# Altium schematic sheet MCU.SchDoc
size A3
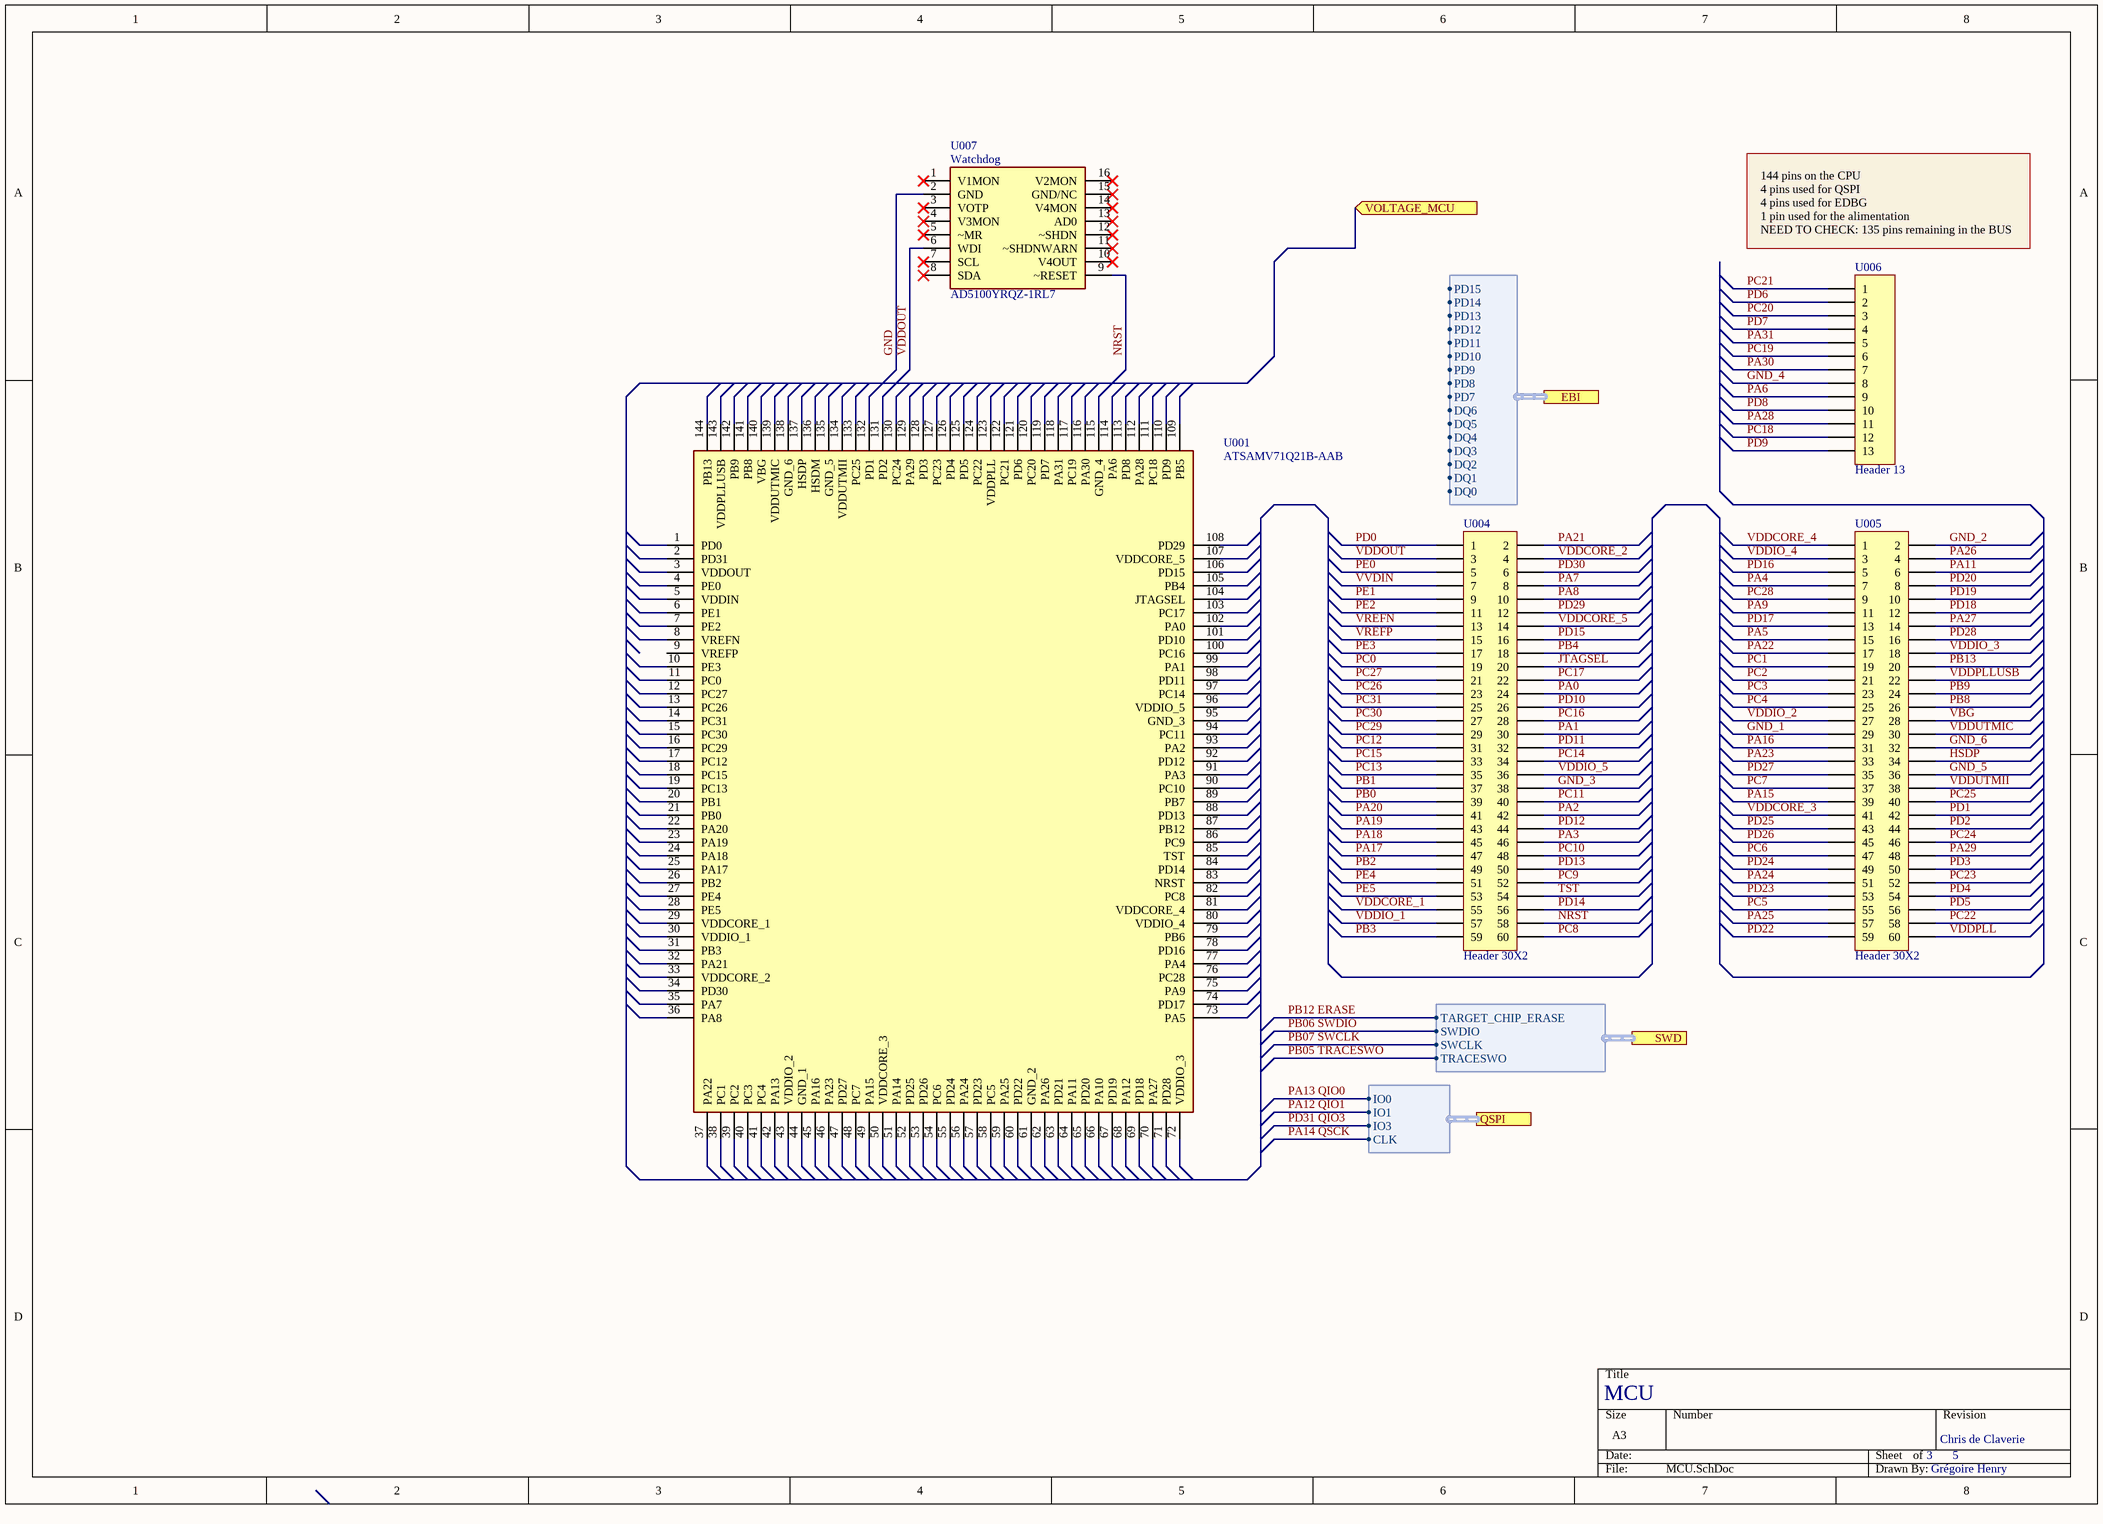
[diagram p0: MCU.SchDoc]

## Parts
U001  ATSAMV71Q21B-AAB  [QFP50P2200X2200X160-144N]
U004  Header 30X2  [HDR2X30]
U005  Header 30X2  [HDR2X30]
U006  Header 13  [HDR1X13]
U007  AD5100YRQZ-1RL7  [SOP65P600X175-16N]

## Ports
EBI (harness *), QSPI (harness *), SWD (harness *), VOLTAGE_MCU (in)

## Harnesses
*: IO0, IO1, IO3, CLK
*: TRACESWO, SWCLK, SWDIO, TARGET_CHIP_ERASE
*: DQ1, DQ0, DQ2, DQ3, DQ4, DQ5, PD7, DQ6, PD8, PD9, PD10, PD13, PD12, PD15, PD14, PD11

## Nets
GND: U007.2(GND)
GND_1: U005.29
GND_2: U005.2
GND_3: U004.38
GND_4: U006.8
GND_5: U005.36
GND_6: U005.32
HSDP: U005.34
JTAGSEL: U004.20
NRST: U004.58 U007.9(~RESET)
PA0: U004.24
PA1: U004.30
PA2: U004.42
PA3: U004.46
PA4: U005.7
PA5: U005.15
PA6: U006.9
PA7: U004.8
PA8: U004.10
PA9: U005.11
PA11: U005.6
PA12 QIO1: port QSPI.IO1
PA13 QIO0: port QSPI.IO0
PA14 QSCK: port QSPI.CLK
PA15: U005.39
PA16: U005.31
PA17: U004.47
PA18: U004.45
PA19: U004.43
PA20: U004.41
PA21: U004.2
PA22: U005.17
PA23: U005.33
PA24: U005.51
PA25: U005.57
PA26: U005.4
PA27: U005.14
PA28: U006.11
PA29: U005.48
PA30: U006.7
PA31: U006.5
PB0: U004.39
PB1: U004.37
PB2: U004.49
PB3: U004.59
PB4: U004.18
PB05 TRACESWO: port SWD.TRACESWO
PB06 SWDIO: port SWD.SWDIO
PB07 SWCLK: port SWD.SWCLK
PB8: U005.26
PB9: U005.24
PB12 ERASE: port SWD.TARGET_CHIP_ERASE
PB13: U005.20
PC0: U004.19
PC1: U005.19
PC2: U005.21
PC3: U005.23
PC4: U005.25
PC5: U005.55
PC6: U005.47
PC7: U005.37
PC8: U004.60
PC9: U004.52
PC10: U004.48
PC11: U004.40
PC12: U004.31
PC13: U004.35
PC14: U004.34
PC15: U004.33
PC16: U004.28
PC17: U004.22
PC18: U006.12
PC19: U006.6
PC20: U006.3
PC21: U006.1
PC22: U005.58
PC23: U005.52
PC24: U005.46
PC25: U005.40
PC26: U004.23
PC27: U004.21
PC28: U005.9
PC29: U004.29
PC30: U004.27
PC31: U004.25
PD0: U004.1
PD1: U005.42
PD2: U005.44
PD3: U005.50
PD4: U005.54
PD5: U005.56
PD6: U006.2
PD7: U006.4
PD8: U006.10
PD9: U006.13
PD10: U004.26
PD11: U004.32
PD12: U004.44
PD13: U004.50
PD14: U004.56
PD15: U004.16
PD16: U005.5
PD17: U005.13
PD18: U005.12
PD19: U005.10
PD20: U005.8
PD22: U005.59
PD23: U005.53
PD24: U005.49
PD25: U005.43
PD26: U005.45
PD27: U005.35
PD28: U005.16
PD29: U004.12
PD30: U004.6
PD31 QIO3: port QSPI.IO3
PE0: U004.5
PE1: U004.9
PE2: U004.11
PE3: U004.17
PE4: U004.51
PE5: U004.53
TST: U004.54
VBG: U005.28
VDDCORE_1: U004.55
VDDCORE_2: U004.4
VDDCORE_3: U005.41
VDDCORE_4: U005.1
VDDCORE_5: U004.14
VDDIO_1: U004.57
VDDIO_2: U005.27
VDDIO_3: U005.18
VDDIO_4: U005.3
VDDIO_5: U004.36
VDDOUT: U004.3 U007.6(WDI)
VDDPLL: U005.60
VDDPLLUSB: U005.22
VDDUTMIC: U005.30
VDDUTMII: U005.38
VREFN: U004.13
VREFP: U004.15
VVDIN: U004.7

Not connected (* = marked no-connect by the designer): U001 1(PD0) 2(PD31) 3(VDDOUT) 4(PE0) 5(VDDIN) 6(PE1) 7(PE2) 8(VREFN) 9(VREFP) 10(PE3) 11(PC0) 12(PC27) 13(PC26) 14(PC31) 15(PC30) 16(PC29) 17(PC12) 18(PC15) 19(PC13) 20(PB1) 21(PB0) 22(PA20) 23(PA19) 24(PA18) 25(PA17) 26(PB2) 27(PE4) 28(PE5) 29(VDDCORE_1) 30(VDDIO_1) 31(PB3) 32(PA21) 33(VDDCORE_2) 34(PD30) 35(PA7) 36(PA8) 37(PA22) 38(PC1) 39(PC2) 40(PC3) 41(PC4) 42(PA13) 43(VDDIO_2) 44(GND_1) 45(PA16) 46(PA23) 47(PD27) 48(PC7) 49(PA15) 50(VDDCORE_3) 51(PA14) 52(PD25) 53(PD26) 54(PC6) 55(PD24) 56(PA24) 57(PD23) 58(PC5) 59(PA25) 60(PD22) 61(GND_2) 62(PA26) 63(PD21) 64(PA11) 65(PD20) 66(PA10) 67(PD19) 68(PA12) 69(PD18) 70(PA27) 71(PD28) 72(VDDIO_3) 73(PA5) 74(PD17) 75(PA9) 76(PC28) 77(PA4) 78(PD16) 79(PB6) 80(VDDIO_4) 81(VDDCORE_4) 82(PC8) 83(NRST) 84(PD14) 85(TST) 86(PC9) 87(PB12) 88(PD13) 89(PB7) 90(PC10) 91(PA3) 92(PD12) 93(PA2) 94(PC11) 95(GND_3) 96(VDDIO_5) 97(PC14) 98(PD11) 99(PA1) 100(PC16) 101(PD10) 102(PA0) 103(PC17) 104(JTAGSEL) 105(PB4) 106(PD15) 107(VDDCORE_5) 108(PD29) 109(PB5) 110(PD9) 111(PC18) 112(PA28) 113(PD8) 114(PA6) 115(GND_4) 116(PA30) 117(PC19) 118(PA31) 119(PD7) 120(PC20) 121(PD6) 122(PC21) 123(VDDPLL) 124(PC22) 125(PD5) 126(PD4) 127(PC23) 128(PD3) 129(PA29) 130(PC24) 131(PD2) 132(PD1) 133(PC25) 134(VDDUTMII) 135(GND_5) 136(HSDM) 137(HSDP) 138(GND_6) 139(VDDUTMIC) 140(VBG) 141(PB8) 142(PB9) 143(VDDPLLUSB) 144(PB13); U007 1(V1MON)* 3(VOTP)* 4(V3MON)* 5(~MR)* 7(SCL)* 8(SDA)* 10(V4OUT)* 11(~SHDNWARN)* 12(~SHDN)* 13(AD0)* 14(V4MON)* 15(GND/NC)* 16(V2MON)*

## Notes on the sheet
- (near U007) Watchdog
- (near U006) 144 pins on the CPU
  4 pins used for QSPI
  4 pins used for EDBG
  1 pin used for the alimentation
  NEED TO CHECK: 135 pins remaining in the BUS
- MCU
- 3
- Chris de Claverie
- 5
- Grégoire Henry

## Library data of the parts
U001 = ATSAMV71Q21B-AAB: Integrated Circuit; Manufacturer_Name: Microchip; Datasheet Link: https://componentsearchengine.com/Datasheets/1/ATSAMV71Q21B-AAB.pdf; Height: 1.6mm; Mouser Part Number: 579-ATSAMV71Q21B-AAB; Mouser Price/Stock: https://www.mouser.com/Search/Refine.aspx?Keyword=579-ATSAMV71Q21B-AAB; Manufacturer_Part_Number: ATSAMV71Q21B-AAB
U004 U005 = Header 30X2: Header, 30-Pin, Dual row; LatestRevisionDate: 17-Jul-2002; LatestRevisionNote: Re-released for DXP Platform.; Publisher: Altium Limited
U006 = Header 13: Header, 13-Pin; LatestRevisionDate: 17-Jul-2002; LatestRevisionNote: Re-released for DXP Platform.; Publisher: Altium Limited
U007 = AD5100YRQZ-1RL7: Integrated Circuit; Manufacturer_Name: Analog Devices; Datasheet Link: https://componentsearchengine.com/Datasheets/1/AD5100YRQZ-1RL7.pdf; Mouser Part Number: 584-AD5100YRQZ-1R7; Mouser Price/Stock: https://www.mouser.com/Search/Refine.aspx?Keyword=584-AD5100YRQZ-1R7; Manufacturer_Part_Number: AD5100YRQZ-1RL7